# EAGLE schematic display (EAGLE 6.1)
clk-sch-01
APVD: B.F. (3-janv-2014); DOC_ID: CLK-SCH-01; DOC_PART_NO: CLK-PC-01; DOC_REV: A; DOC_TITLE: LED matrix display board; PROJECT_NAME: Alarm clock
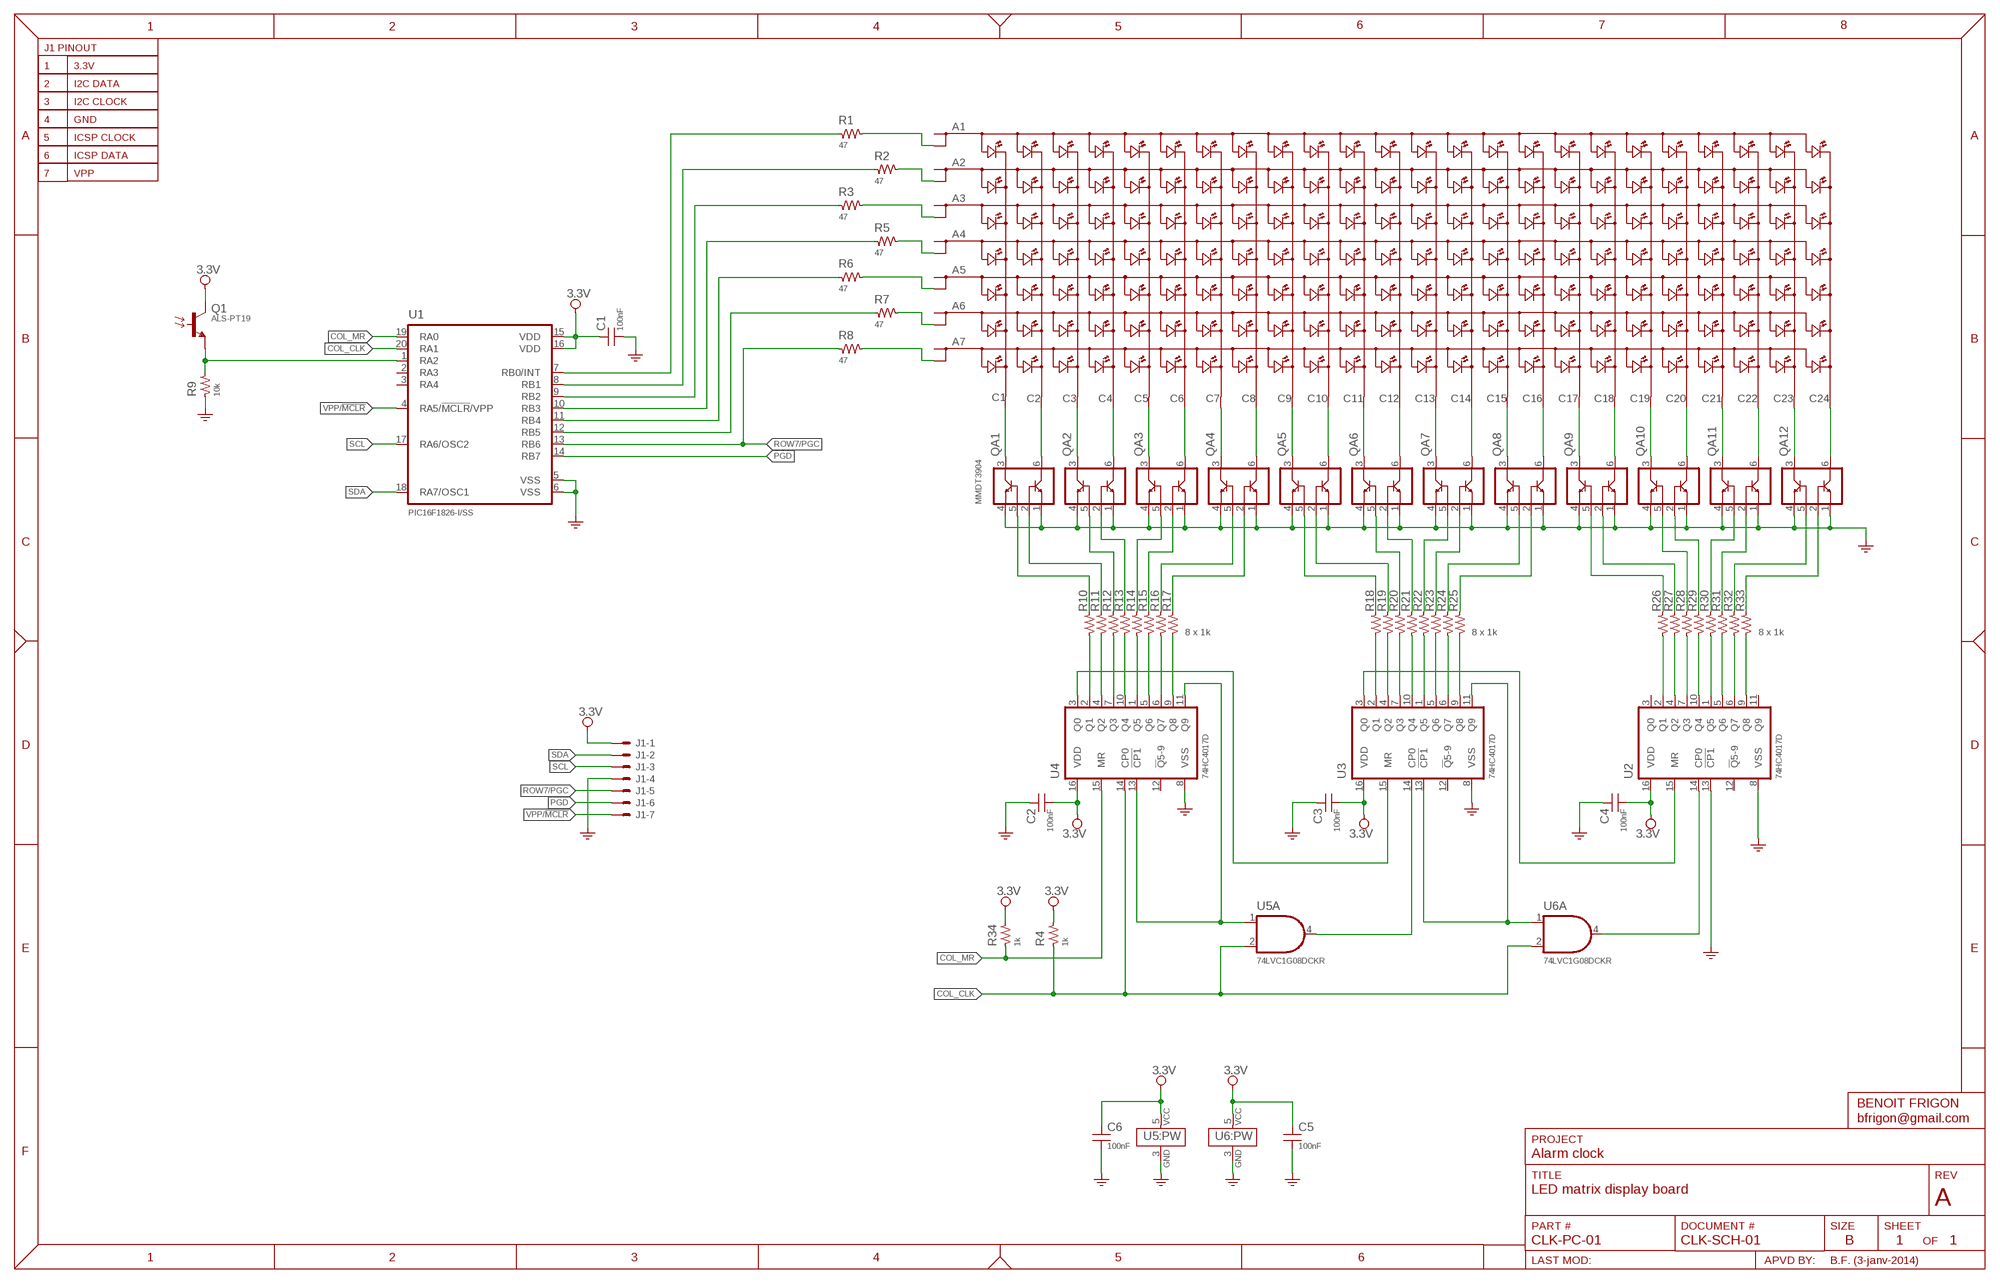
[diagram p0: schematic, sheet 1]

## Parts
C1  100nF  CAP-0603  [SMD_0603]
C2  100nF  CAP-0603  [SMD_0603]
C3  100nF  CAP-0603  [SMD_0603]
C4  100nF  CAP-0603  [SMD_0603]
C5  100nF  CAP-0603  [SMD_0603]
C6  100nF  CAP-0603  [SMD_0603]
J1  SNG-2MM-HEADER-07-V  [DF3X-7P-2DSA]
Q1  ALS-PT19  [ALS-PT19]
QA1  MMDT3904  [SOT363]
QA2  MMDT3904  [SOT363]
QA3  MMDT3904  [SOT363]
QA4  MMDT3904  [SOT363]
QA5  MMDT3904  [SOT363]
QA6  MMDT3904  [SOT363]
QA7  MMDT3904  [SOT363]
QA8  MMDT3904  [SOT363]
QA9  MMDT3904  [SOT363]
QA10  MMDT3904  [SOT363]
QA11  MMDT3904  [SOT363]
QA12  MMDT3904  [SOT363]
R1  47  RES-0603  [SMD_0603]
R2  47  RES-0603  [SMD_0603]
R3  47  RES-0603  [SMD_0603]
R4  1k  RES-0603  [SMD_0603]
R5  47  RES-0603  [SMD_0603]
R6  47  RES-0603  [SMD_0603]
R7  47  RES-0603  [SMD_0603]
R8  47  RES-0603  [SMD_0603]
R9  10k  RES-0603  [SMD_0603]
R10  1k  RES-0603  [SMD_0603]
R11  1k  RES-0603  [SMD_0603]
R12  1k  RES-0603  [SMD_0603]
R13  1k  RES-0603  [SMD_0603]
R14  1k  RES-0603  [SMD_0603]
R15  1k  RES-0603  [SMD_0603]
R16  1k  RES-0603  [SMD_0603]
R17  1k  RES-0603  [SMD_0603]
R18  1k  RES-0603  [SMD_0603]
R19  1k  RES-0603  [SMD_0603]
R20  1k  RES-0603  [SMD_0603]
R21  1k  RES-0603  [SMD_0603]
R22  1k  RES-0603  [SMD_0603]
R23  1k  RES-0603  [SMD_0603]
R24  1k  RES-0603  [SMD_0603]
R25  1k  RES-0603  [SMD_0603]
R26  1k  RES-0603  [SMD_0603]
R27  1k  RES-0603  [SMD_0603]
R28  1k  RES-0603  [SMD_0603]
R29  1k  RES-0603  [SMD_0603]
R30  1k  RES-0603  [SMD_0603]
R31  1k  RES-0603  [SMD_0603]
R32  1k  RES-0603  [SMD_0603]
R33  1k  RES-0603  [SMD_0603]
R34  1k  RES-0603  [SMD_0603]
U1  PIC16F1826-I/SS  [SSOP20]
U2  74HC4017D  [SOIC16N]
U3  74HC4017D  [SOIC16N]
U4  74HC4017D  [SOIC16N]
U5  74LVC1G08DCKR  [SC70-5]
U6  74LVC1G08DCKR  [SC70-5]
U$1  LED_MATRIX_V_24X7  [LED_MATRIX_V_24X7]

## Nets
3.3V: C1.1 C2.2 C3.2 C4.2 C5.1 C6.1 J1.1 Q1.C R4.2 R34.2 U1.15(VDD) U1.16(VDD) U2.16(VDD) U3.16(VDD) U4.16(VDD) U5.5(:PW:VCC) U6.5(:PW:VCC)
COL_CLK: R4.1 U1.20(RA1) U4.14(CP0) U5.2(A:I1) U6.2(A:I1)
COL_MR: R34.1 U1.19(RA0) U4.15(MR)
GND: C1.2 C2.1 C3.1 C4.1 C5.2 C6.2 J1.4 QA1.1(E2) QA1.4(E1) QA2.1(E2) QA2.4(E1) QA3.1(E2) QA3.4(E1) QA4.1(E2) QA4.4(E1) QA5.1(E2) QA5.4(E1) QA6.1(E2) QA6.4(E1) QA7.1(E2) QA7.4(E1) QA8.1(E2) QA8.4(E1) QA9.1(E2) QA9.4(E1) QA10.1(E2) QA10.4(E1) QA11.1(E2) QA11.4(E1) QA12.1(E2) QA12.4(E1) R9.1 U1.5(VSS) U1.6(VSS) U2.8(VSS) U2.13(!CP1) U3.8(VSS) U4.8(VSS) U5.3(:PW:GND) U6.3(:PW:GND)
N$1: R8.2 U$1.A7@2(A7)
N$2: R7.2 U$1.A6@2(A6)
N$3: R6.2 U$1.A5@2(A5)
N$4: R5.2 U$1.A4@2(A4)
N$5: R3.2 U$1.A3@2(A3)
N$6: R2.2 U$1.A2@2(A2)
N$7: R1.2 U$1.A1@2(A1)
N$14: Q1.E R9.2 U1.1(RA2)
N$15: QA12.6(C2) U$1.C24
N$16: QA12.3(C1) U$1.C23
N$17: QA11.6(C2) U$1.C22
N$18: QA11.3(C1) U$1.C21
N$19: QA10.6(C2) U$1.C20
N$20: QA10.3(C1) U$1.C19
N$21: QA9.6(C2) U$1.C18
N$22: QA9.3(C1) U$1.C17
N$23: QA8.6(C2) U$1.C16
N$24: QA8.3(C1) U$1.C15
N$25: QA7.6(C2) U$1.C14
N$26: QA7.3(C1) U$1.C13
N$27: QA6.6(C2) U$1.C12
N$28: QA6.3(C1) U$1.C11
N$29: QA5.6(C2) U$1.C10
N$30: QA5.3(C1) U$1.C9
N$31: QA4.6(C2) U$1.C8
N$32: QA4.3(C1) U$1.C7
N$33: QA3.6(C2) U$1.C6
N$34: QA3.3(C1) U$1.C5
N$35: QA2.6(C2) U$1.C4
N$36: QA2.3(C1) U$1.C3
N$37: QA1.6(C2) U$1.C2
N$38: QA1.3(C1) U$1.C1
N$39: QA9.5(B1) R26.2
N$40: QA9.2(B2) R27.2
N$41: QA10.5(B1) R28.2
N$42: QA10.2(B2) R29.2
N$43: QA11.5(B1) R30.2
N$44: QA11.2(B2) R31.2
N$45: QA12.5(B1) R32.2
N$46: QA12.2(B2) R33.2
N$47: QA8.2(B2) R25.2
N$48: QA8.5(B1) R24.2
N$49: QA7.2(B2) R23.2
N$50: QA7.5(B1) R22.2
N$51: QA6.2(B2) R21.2
N$52: QA6.5(B1) R20.2
N$53: R10.1 U4.2(Q1)
N$54: QA5.2(B2) R19.2
N$55: QA5.5(B1) R18.2
N$56: QA4.2(B2) R17.2
N$57: QA4.5(B1) R16.2
N$58: QA3.2(B2) R15.2
N$59: QA3.5(B1) R14.2
N$60: QA2.2(B2) R13.2
N$61: QA2.5(B1) R12.2
N$62: QA1.2(B2) R11.2
N$63: QA1.5(B1) R10.2
N$64: U4.11(Q9) U4.13(!CP1) U5.1(A:I0)
N$65: U3.14(CP0) U5.4(A:O)
N$66: U3.15(MR) U4.3(Q0)
N$67: U2.15(MR) U3.3(Q0)
N$68: U3.11(Q9) U3.13(!CP1) U6.1(A:I0)
N$69: U2.14(CP0) U6.4(A:O)
N$70: R11.1 U4.4(Q2)
N$71: R12.1 U4.7(Q3)
N$72: R13.1 U4.10(Q4)
N$73: R14.1 U4.1(Q5)
N$74: R15.1 U4.5(Q6)
N$75: R16.1 U4.6(Q7)
N$76: R17.1 U4.9(Q8)
N$77: R18.1 U3.2(Q1)
N$78: R19.1 U3.4(Q2)
N$79: R21.1 U3.10(Q4)
N$80: R20.1 U3.7(Q3)
N$81: R22.1 U3.1(Q5)
N$82: R23.1 U3.5(Q6)
N$83: R24.1 U3.6(Q7)
N$84: R25.1 U3.9(Q8)
N$85: R26.1 U2.2(Q1)
N$86: R27.1 U2.4(Q2)
N$87: R28.1 U2.7(Q3)
N$88: R29.1 U2.10(Q4)
N$89: R30.1 U2.1(Q5)
N$90: R31.1 U2.5(Q6)
N$91: R32.1 U2.6(Q7)
N$92: R33.1 U2.9(Q8)
PGD: J1.6 U1.14(RB7)
ROW1: R1.1 U1.7(RB0/INT)
ROW2: R2.1 U1.8(RB1)
ROW3: R3.1 U1.9(RB2)
ROW4: R5.1 U1.10(RB3)
ROW5: R6.1 U1.11(RB4)
ROW6: R7.1 U1.12(RB5)
ROW7/PGC: J1.5 R8.1 U1.13(RB6)
SCL: J1.3 U1.17(RA6/OSC2)
SDA: J1.2 U1.18(RA7/OSC1)
VPP/!MCLR: J1.7 U1.4(RA5/!MCLR!/VPP)
Unconnected: U1.2(RA3) U1.3(RA4) U2.3(Q0) U2.11(Q9) U2.12(!Q!5-9) U3.12(!Q!5-9) U4.12(!Q!5-9) U$1.A1@1(A1) U$1.A2@1(A2) U$1.A3@1(A3) U$1.A4@1(A4) U$1.A5@1(A5) U$1.A6@1(A6) U$1.A7@1(A7)

## Notes on the sheet
- 8 x 1k | 8 x 1k | 8 x 1k

## Library data of the parts
C1-C4 = Passive:CAP: Capacitor; DESCRIPTION: {DESCRIPTION} - SMT 0603 - {value}; PACKAGE: SMT 0603; PRICE: 0.00
C5 C6 = Passive:CAP: Capacitor; DESCRIPTION: {DESCRIPTION} - SMT 0603 - {value}; PACKAGE: SMT 0603
J1 = Connectors:SNG-2MM-HEADER-07: 2mm Single Row Header - 7 pos; DESCRIPTION: {DESCRIPTION} - SMT Vertical; MFG: Hirose Electronic; PART_NO: DF3A-7P-2DSA; PRICE: 0.37; SKU: H2099-ND; SUPPLIER: Digi-Key
Q1 = Optoelectronic:ALS-PT19: Ambiant light sensor; MFG: Everlight; PART_NO: ALS-PT19-315C/L177/TR8; PRICE: 0.70; SKU: 1080-1244-1-ND; SUPPLIER: Digi-Key
QA1-QA12 = Transistor:MMDT3904: NPN transistor - dual; MFG: Diodes Inc.; PRICE: 0.37; SKU: MMDT3904-FDICT-ND; SUPPLIER: Digi-Key
R1-R8 R10-R34 = Passive:RES: Resistor; DESCRIPTION: {DESCRIPTION} - SMT 0603 - {VALUE}; PACKAGE: SMT 0603; PRICE: 0.00
R9 = Passive:RES: Resistor; DESCRIPTION: {DESCRIPTION} - SMT 0603 - {VALUE}; PACKAGE: SMT 0603
U1 = IC:PIC16*F1826-?: 20 Pin Flash Microcontroller; MFG: Microchip; PRICE: 1.92; SKU: PIC16F1826-I/SS-ND; SUPPLIER: Digi-Key
U2-U4 = IC:74HC4017: Johnson decade counter; MFG: NXP Semiconductors; PART_NO: 74HC4017D,653; PRICE: 0.77; SKU: 568-8146-1-ND; SUPPLIER: Digi-Key
U5 U6 = Logic:74*1G08: 2-input AND gate; MFG: Texas Instruments; PRICE: 0.29; SKU: 296-11602-1-ND; SUPPLIER: Digi-Key
U$1 = Misc:LED_MATRIX_V_24X7; BOM: NO